# EAGLE schematic LED_DRIVER (EAGLE 6.1)
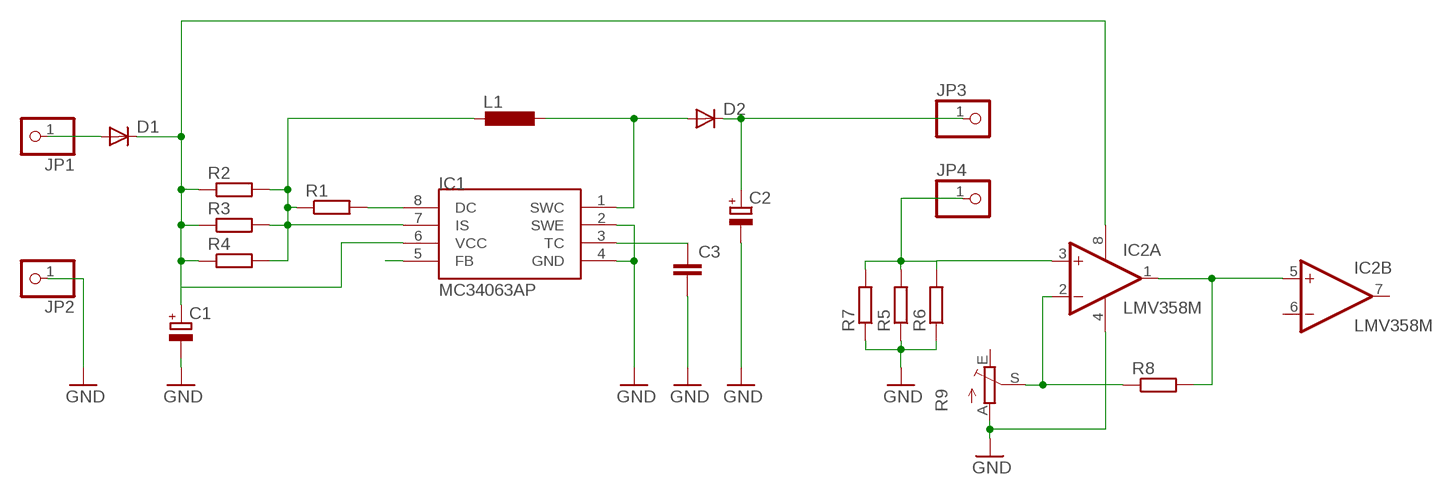
[diagram p0: schematic, sheet 1]

## Parts
C1  CPOL-EUE3.5-10  [E3,5-10]
C2  CPOL-EUE3.5-10  [E3,5-10]
C3  C-EU025-025X050  [C025-025X050]
D1  DIODE-DO214BA  [DO214BA]
D2  DIODE-DO214BA  [DO214BA]
IC1  MC34063AP  [DIL08]
IC2  LMV358M  [SO08]
JP1  PINHD-1X1  [1X01]
JP2  PINHD-1X1  [1X01]
JP3  PINHD-1X1  [1X01]
JP4  PINHD-1X1  [1X01]
L1  DO3316P  [DO3316P]
R1  R-EU_R1206W  [R1206W]
R2  R-EU_R1206W  [R1206W]
R3  R-EU_R1206W  [R1206W]
R4  R-EU_R1206W  [R1206W]
R5  R-EU_R1206W  [R1206W]
R6  R-EU_R1206W  [R1206W]
R7  R-EU_R1206W  [R1206W]
R8  R-EU_R1206W  [R1206W]
R9  TRIM_EU-S64W  [S64W]

## Nets
GND: C1.- C2.- C3.2 IC1.2(SWE) IC1.4(GND) IC2.4(P:V-) JP2.1 R5.1 R6.1 R7.1 R9.A
N$1: IC1.8(DC) R1.2
N$2: IC1.7(IS) L1.1 R1.1 R2.2 R3.2 R4.2
N$3: C1.+ D1.C IC1.6(VCC) IC2.8(P:V+) R2.1 R3.1 R4.1
N$4: D2.A IC1.1(SWC) L1.2
N$5: D1.A JP1.1
N$6: C2.+ D2.C JP3.1
N$7: IC2.1(A:OUT) IC2.5(B:+IN) R8.2
N$8: IC2.3(A:+IN) JP4.1 R5.2 R6.2 R7.2
N$9: C3.1 IC1.3(TC)
N$10: IC2.2(A:-IN) R8.1 R9.S
N$11: IC1.5(FB)
Unconnected: IC2.6(B:-IN) IC2.7(B:OUT) R9.E

## Library data of the parts
C1 C2 = rcl:CPOL-EU: POLARIZED CAPACITOR, European symbol
C3 = rcl:C-EU: CAPACITOR, European symbol
D1 D2 = diode:DIODE-: DIODE
IC1 = mc34063:MC34063
IC2 = linear:LMV358?*: Dual General Purpose, Low Voltage, Rail-to-Rail Output Operational Amplifiers Source: http://www.national.com/mpf/LM/LMV321.html http://www.national.com/dt/lmv_qual.pdf
JP1-JP4 = pinhead:PINHD-1X1: PIN HEADER
L1 = inductor-coilcraft:DO3316P: COILCRAFT; OC_FARNELL: unknown; OC_NEWARK: unknown
R1-R8 = rcl:R-EU_: RESISTOR, European symbol
R9 = pot:TRIM_EU-: POTENTIOMETER